# EAGLE design XBee-Breakout-v12 (EAGLE 5.01)
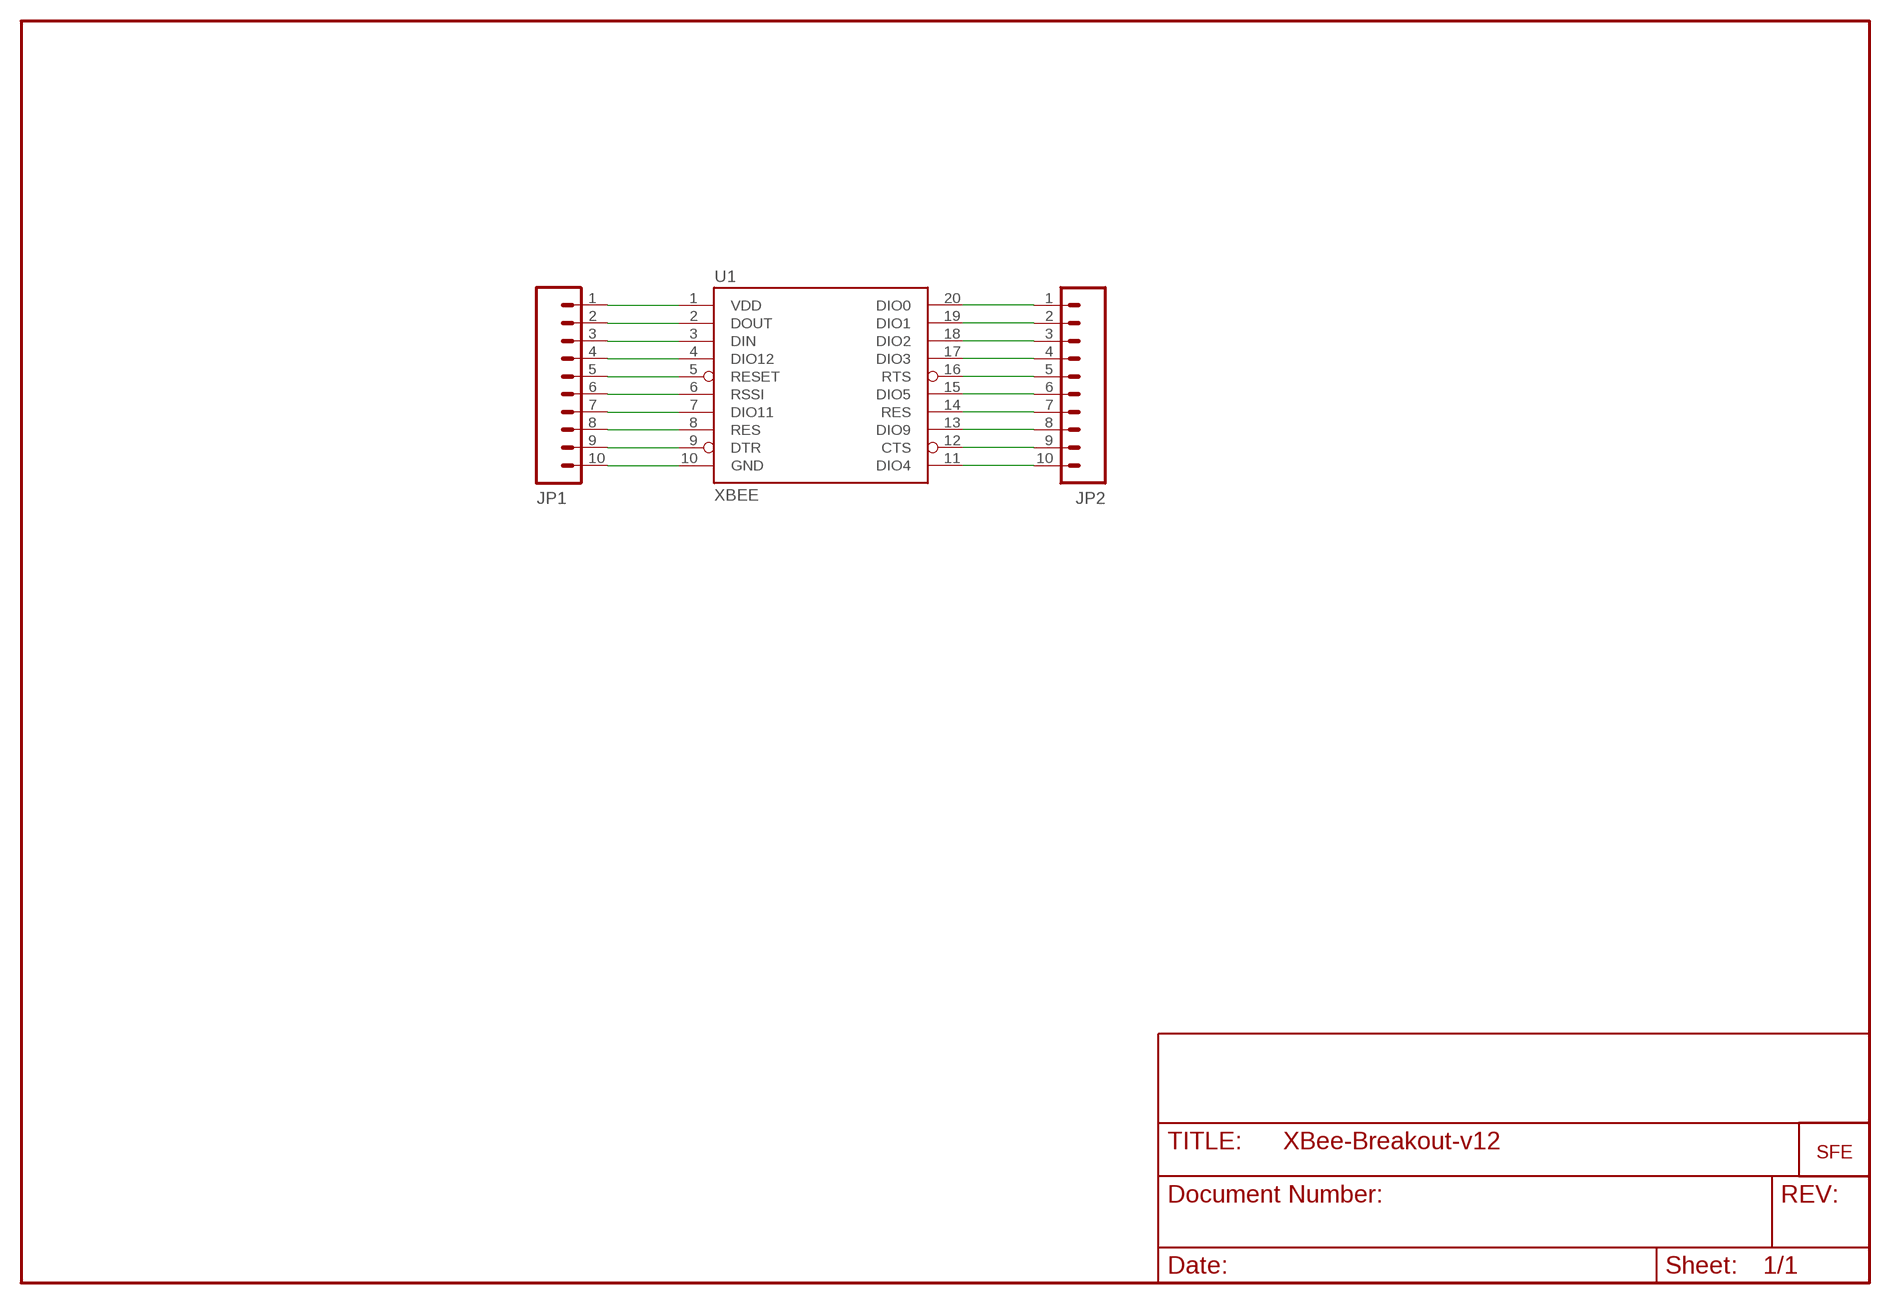
[diagram p0: schematic, sheet 1]

## Parts
JP1  M100.1  [1X10]
JP2  M100.1  [1X10]
U1  XBEE  XBEE-1B1  [XBEE-1]
U$2  LOGO-SFENEW  [SFE-NEW-WEBLOGO]

## Nets
N$1: JP1.5 U1.5(RESET)
N$21: JP1.1 U1.1(VDD)
N$22: JP1.2 U1.2(DOUT)
N$23: JP1.3 U1.3(DIN)
N$24: JP1.4 U1.4(DIO12)
N$26: JP1.6 U1.6(RSSI)
N$27: JP1.7 U1.7(DIO11)
N$28: JP1.8 U1.8(RES)
N$29: JP1.9 U1.9(DTR)
N$30: JP1.10 U1.10(GND)
N$31: JP2.10 U1.11(DIO4)
N$32: JP2.9 U1.12(CTS)
N$33: JP2.8 U1.13(DIO9)
N$34: JP2.7 U1.14(RES)
N$35: JP2.6 U1.15(DIO5)
N$36: JP2.5 U1.16(RTS)
N$37: JP2.4 U1.17(DIO3)
N$38: JP2.3 U1.18(DIO2)
N$39: JP2.2 U1.19(DIO1)
N$40: JP2.1 U1.20(DIO0)

## Library data of the parts
JP1 JP2 = SparkFun:M10: Header 10 Standard 10-pin 0.1" header. Use with straight break away headers (SKU : PRT-00116), right angle break away headers (PRT-00553), swiss pins (PRT-00743), machine pins (PRT-00117), and female headers (PRT-00115).
U1 = SparkFun:XBEE-1
U$2 = SparkFun:LOGO-SFE: Spark Fun Electronics PCB Logo This is the standard Spark Fun Electronics PCB logo.

## Net classes
0 default: width 0.254 mm
1 power: width 0.305 mm

## Board
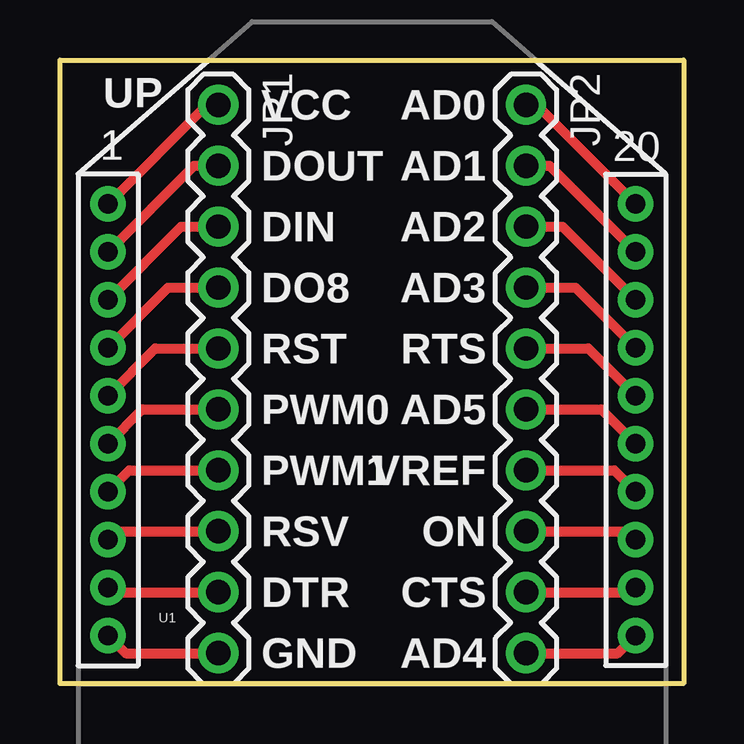
[diagram p1: board, top side]
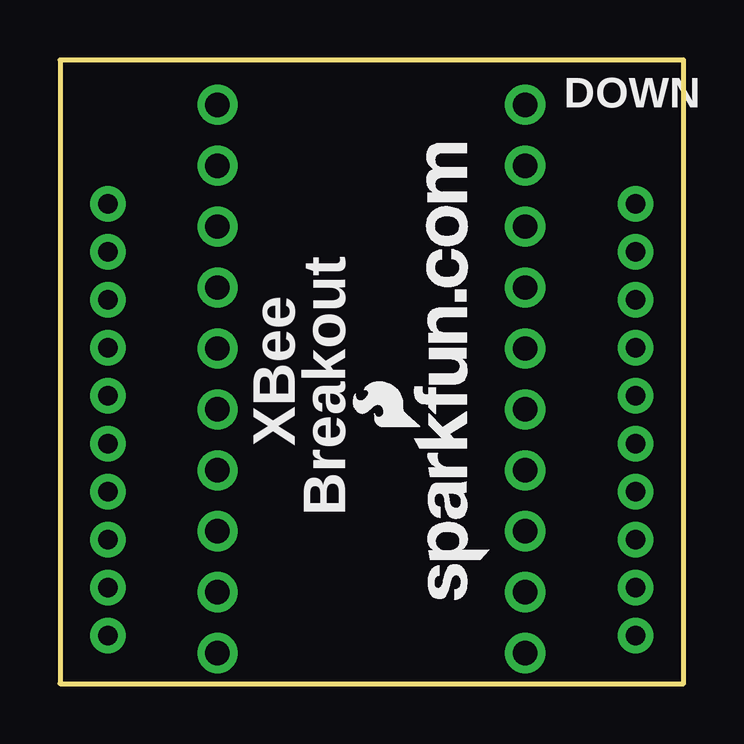
[diagram p2: board, bottom side, seen from below]

Size 26 x 26 mm. Coordinates in mm from the lower left corner, seen from the top.
Outline: 0,26 26,26 26,0 0,0 0,26
Copper layers (1*16): Top 0.035mm / dielectric 1.5mm / Bottom 0.035mm
Design rules "SparkFun *": minimum track width 16mil, minimum drill 24mil, track to track 8mil, track to pad 8mil, pad to pad 8mil, via to via 8mil, smd to smd 8mil, copper to edge 10mil, drill to drill 8mil, minimum pad ring 13mil, minimum via ring 10mil, stop-mask expansion 4mil, vias tented up to drill 20mil, thermal gap 10mil

### Footprints (pad centres in the part's own frame; a part is rotated, then mirrored left to right if it is on the bottom)
1X10 = drill 1.016: 1 0,0; 2 2.54,0; 3 5.08,0; 4 7.62,0; 5 10.16,0; 6 12.7,0; 7 15.24,0; 8 17.78,0; 9 20.32,0; 10 22.86,0
XBEE-1 = drill 0.8: 1 -11,20; 2 -11,18; 3 -11,16; 4 -11,14; 5 -11,12; 6 -11,10; 7 -11,8; 8 -11,6; 9 -11,4; 10 -11,2; 11 11,2; 12 11,4; 13 11,6; 14 11,8; 15 11,10; 16 11,12; 17 11,14; 18 11,16; 19 11,18; 20 11,20

### Placement (x,y rotation side)
JP1  6.6,24.13 270 top
JP2  19.43,24.13 270 top
U1  13,0 0 top
U$2  8.1,3.5 90 bottom

### Tracks (layer width: path | path; a pad name or v marks a point on that pad's centre or on a via)
N$1
  Top 0.406: U1.5 3.97,13.97 JP1.5
N$21
  Top 0.406: U1.1 6.13,24.13 JP1.1
N$22
  Top 0.406: U1.2 5.59,21.59 JP1.2
N$23
  Top 0.406: U1.3 5.05,19.05 JP1.3
N$24
  Top 0.406: U1.4 4.51,16.51 JP1.4
N$26
  Top 0.406: U1.6 3.43,11.43 JP1.6
N$27
  Top 0.406: U1.7 2.89,8.89 JP1.7
N$28
  Top 0.406: U1.8 2.35,6.35 JP1.8
N$29
  Top 0.406: U1.9 2.19,3.81 JP1.9
N$30
  Top 0.406: U1.10 2.73,1.27 JP1.10
N$31
  Top 0.406: U1.11 23.27,1.27 JP2.10
N$32
  Top 0.406: U1.12 23.81,3.81 JP2.9
N$33
  Top 0.406: U1.13 23.65,6.35 JP2.8
N$34
  Top 0.406: U1.14 23.11,8.89 JP2.7
N$35
  Top 0.406: U1.15 22.57,11.43 JP2.6
N$36
  Top 0.406: U1.16 22.03,13.97 JP2.5
N$37
  Top 0.406: U1.17 21.49,16.51 JP2.4
N$38
  Top 0.406: U1.18 20.95,19.05 JP2.3
N$39
  Top 0.406: U1.19 20.41,21.59 JP2.2
N$40
  Top 0.406: U1.20 19.87,24.13 JP2.1

### Text on the board
tPlace: AD0 | UP | VCC | 1 | AD1 | 20 | DOUT | AD2 | DIN | AD3 | DO8 | RTS | RST | AD5 | PWM0 | VREF | PWM1 | ON | RSV | CTS | DTR | AD4 | GND
bPlace: DOWN | XBee | Breakout